# Altium schematic sheet G431_Dev_V2.SchDoc: G431 DEV BRD
size A2; Author: OldGerman; Address1: Author: OldGerman; Address2: License: CC BY-SA 4.0; Revision: v1.0
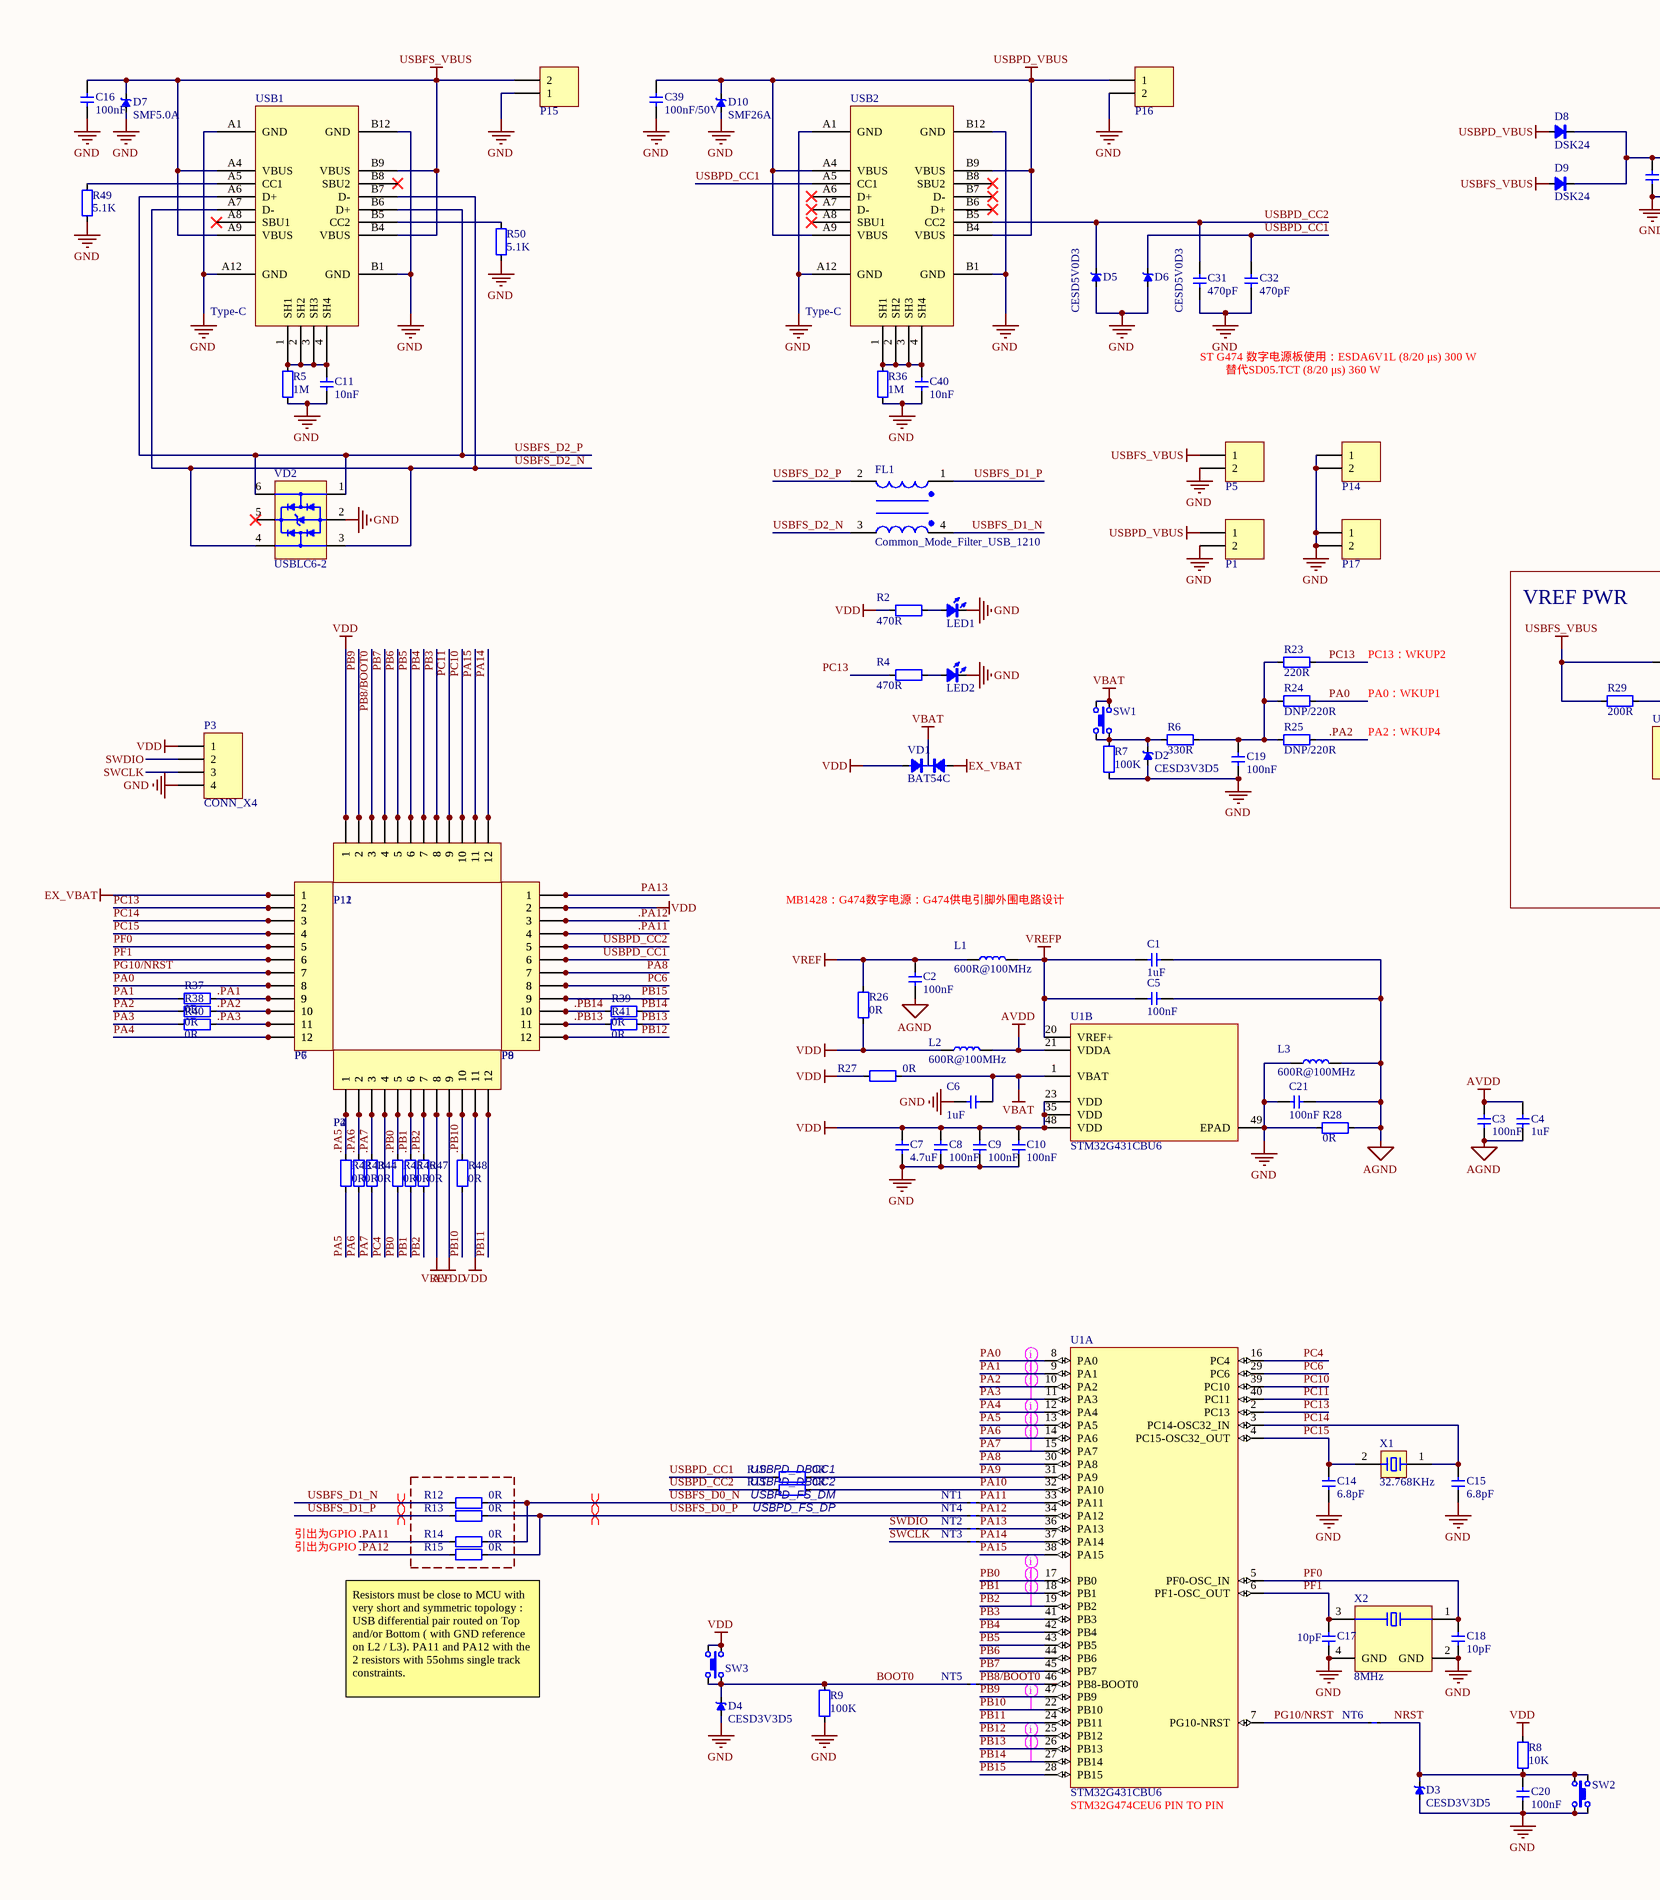
[diagram p0: G431_Dev_V2.SchDoc, left]
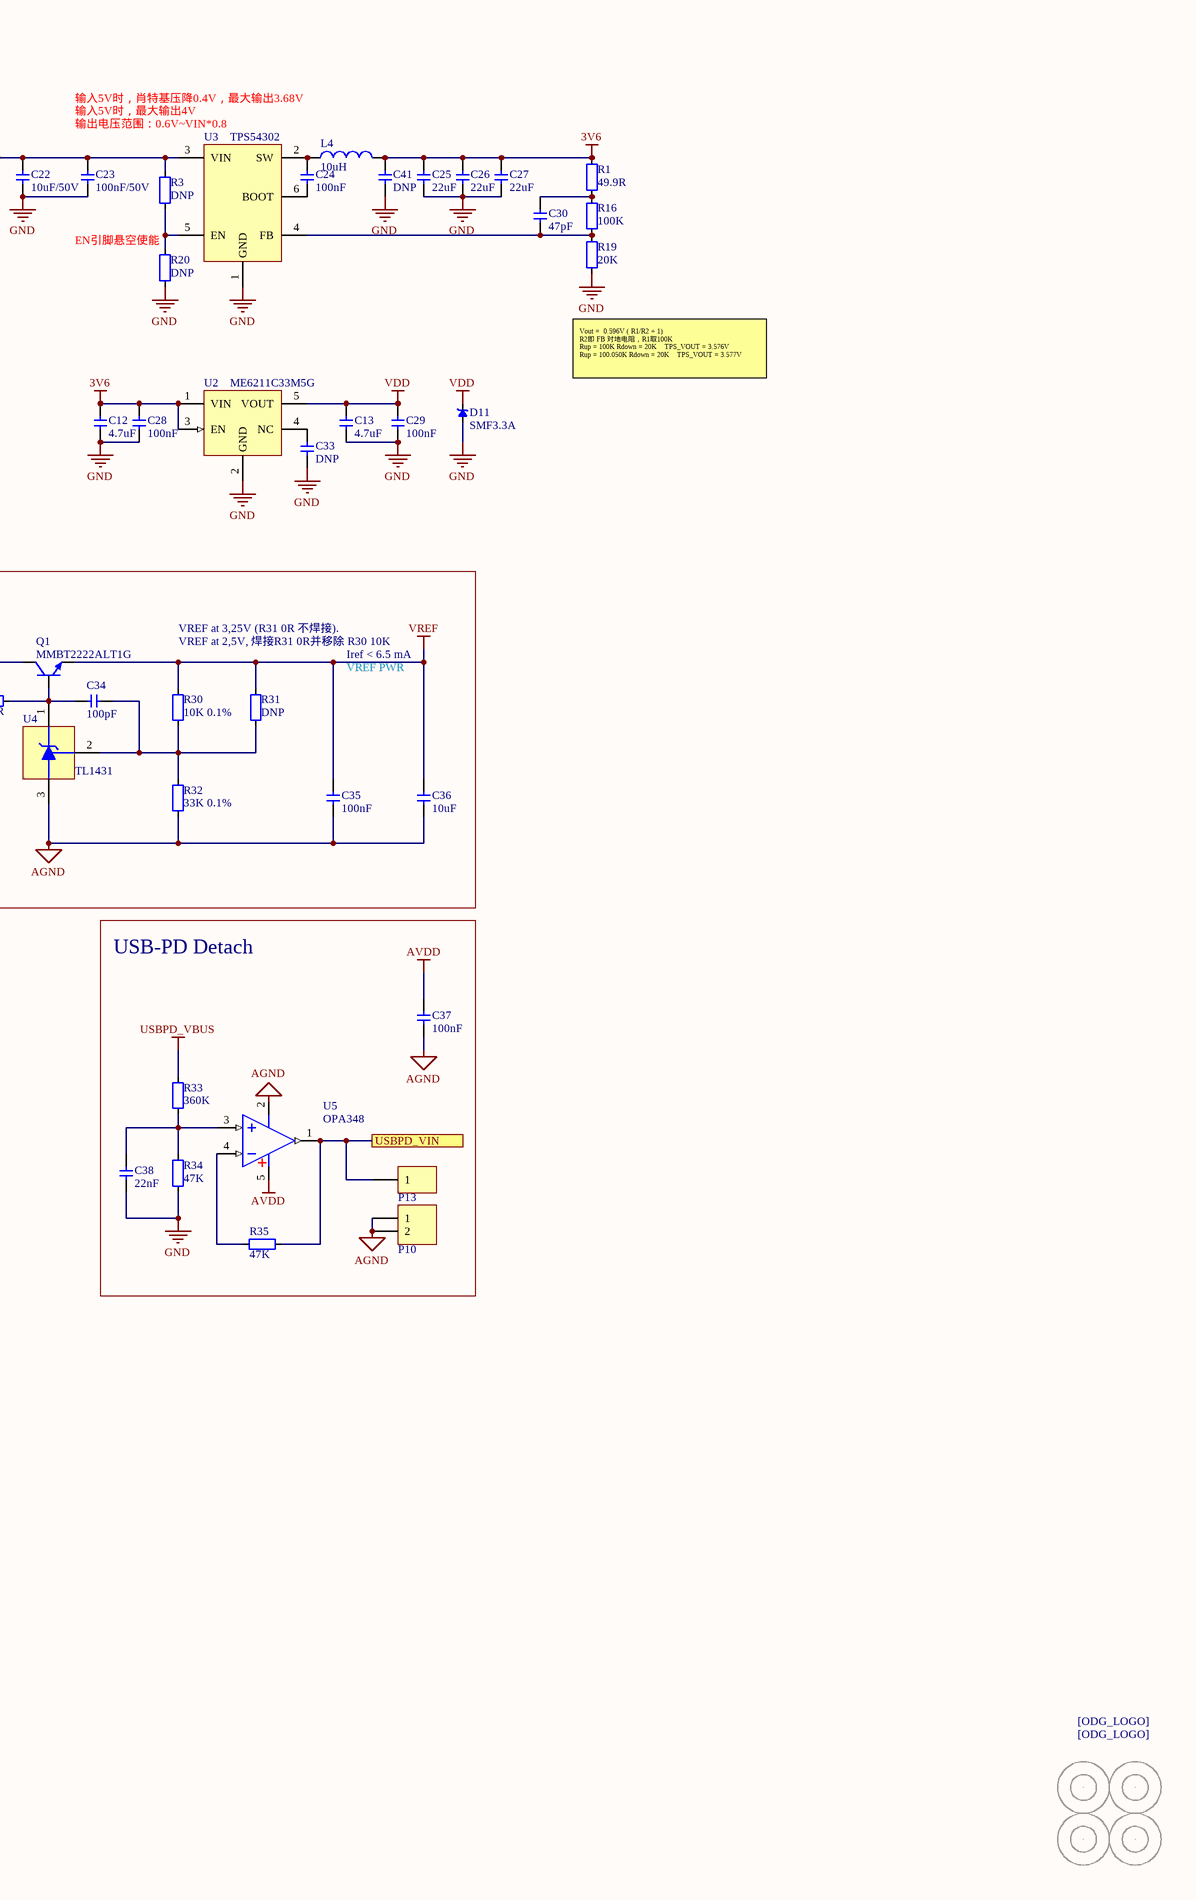
[diagram p1: G431_Dev_V2.SchDoc, right]

## Parts
*1  ODG_LOGO  [ODG_LOGO]  (value not drawn)
*2  ODG_LOGO  [ODG_LOGO]  (value not drawn)
C1  1uF  [C0603]
C2  100nF  [C0402]
C3  100nF  [C0402]
C4  1uF  [C0603]
C5  100nF  [C0402]
C6  1uF  [C0603]
C7  4.7uF  [C0603]
C8  100nF  [C0402]
C9  100nF  [C0402]
C10  100nF  [C0402]
C11  10nF  [C0402]
C12  4.7uF  [C0603]
C13  4.7uF  [C0603]
C14  6.8pF  [C0402]
C15  6.8pF  [C0402]
C16  100nF  [C0402]
C17  10pF  [C0402]
C18  10pF  [C0402]
C19  100nF  [C0402]
C20  100nF  [C0402]
C21  100nF  [C0402]
C22  10uF/50V  [C1206]
C23  100nF/50V  [C0402]
C24  100nF  [C0402]
C25  22uF  [C0805]
C26  22uF  [C0805]
C27  22uF  [C0603]
C28  100nF  [C0402]
C29  100nF  [C0402]
C30  47pF  [C0402]
C31  470pF  [C0402]
C32  470pF  [C0402]
C33  DNP  [C0402]
C34  100pF  [C0402]
C35  100nF  [C0402]
C36  10uF  [C0603]
C37  100nF  [C0402]
C38  22nF  [C0402]
C39  100nF/50V  [C0402]
C40  10nF  [C0402]
C41  DNP  [C0805]
D2  CESD3V3D5  [SOD-523]
D3  CESD3V3D5  [SOD-523]
D4  CESD3V3D5  [SOD-523]
D5  CESD5V0D3  [SOD-323]
D6  CESD5V0D3  [SOD-323]
D7  SMF5.0A  [SOD123F]
D8  DSK24  [SOD123F]
D9  DSK24  [SOD123F]
D10  SMF26A  [SOD123F]
D11  SMF3.3A  [SOD123F]
FL1  Common_Mode_Filter_USB_1210  [FIL_1210_DLP11RB400UL2L]
H1  HOLE  [M2.1 D=4.2]  (value not drawn)
H2  HOLE  [M2.1 D=4.2]  (value not drawn)
H3  HOLE  [M2.1 D=4.2]  (value not drawn)
H4  HOLE  [M2.1 D=4.2]  (value not drawn)
L1  600R@100MHz  [FER0603]
L2  600R@100MHz  [FER0603]
L3  600R@100MHz  [FER0603]
L4  10uH  [INDUCTOR 0420 4.6X4.1X2MM]
LED1  LED  [LED0603_GREEN]  (value not drawn)
LED2  LED  [LED0603_BLUE]  (value not drawn)
NT1  NetTie  [NetTie_D=10MIL_C=10MIL]  (value not drawn)  (net tie, no BOM)
NT2  NetTie  [NetTie_D=10MIL_C=10MIL]  (value not drawn)  (net tie, no BOM)
NT3  NetTie  [NetTie_D=10MIL_C=10MIL]  (value not drawn)  (net tie, no BOM)
NT4  NetTie  [NetTie_D=10MIL_C=10MIL]  (value not drawn)  (net tie, no BOM)
NT5  NetTie  [NetTie_D=10MIL_C=10MIL]  (value not drawn)  (net tie, no BOM)
NT6  NetTie  [NetTie_D=10MIL_C=10MIL]  (value not drawn)  (net tie, no BOM)
P1  CONN_X2  [2.54mm_Male_x2]  (value not drawn)
P2  CONN_X12  [2.54MM_MALE_X12]  (value not drawn)
P3  CONN_X4  [2.54mm_Male_x4]
P4  CONN_X12  [2.54MM_MALE_X12]  (value not drawn)
P5  CONN_X2  [2.54mm_Male_x2]  (value not drawn)
P6  CONN_X12  [2.54MM_MALE_X12]  (value not drawn)
P7  CONN_X12  [2.54MM_MALE_X12]  (value not drawn)
P8  CONN_X12  [2.54MM_MALE_X12]  (value not drawn)
P9  CONN_X12  [2.54MM_MALE_X12]  (value not drawn)
P10  CONN_X2  [2.54mm_Male_x2]  (value not drawn)
P11  CONN_X12  [2.54MM_MALE_X12]  (value not drawn)
P12  CONN_X12  [2.54MM_MALE_X12]  (value not drawn)
P13  CONN_X1  [2.54mm_Male_x1]  (value not drawn)
P14  CONN_X2  [2.54mm_Male_x2]  (value not drawn)
P15  CONN_X2  [TE_1776275-2]  (value not drawn)
P16  CONN_X2  [TE_1776275-2]  (value not drawn)
P17  CONN_X2  [2.54mm_Male_x2]  (value not drawn)
Q1  MMBT2222ALT1G  [INFINEON SOT-23-3]
R1  49.9R  [R0402]
R2  470R  [R0402]
R3  DNP  [R0402]
R4  470R  [R0402]
R5  1M  [R0402]
R6  330R  [R0402]
R7  100K  [R0402]
R8  10K  [R0402]
R9  100K  [R0402]
R10  0R  [R0402]
R11  0R  [R0402]
R12  0R  [R0402]
R13  0R  [R0402]
R14  0R  [R0402]
R15  0R  [R0402]
R16  100K  [R0402]
R19  20K  [R0402]
R20  DNP  [R0402]
R23  220R  [R0402]
R24  DNP/220R  [R0402]
R25  DNP/220R  [R0402]
R26  0R  [R0402]
R27  0R  [R0402]
R28  0R  [R0402]
R29  200R  [R0402]
R30  10K 0.1%  [R0402]
R31  DNP  [R0402]
R32  33K 0.1%  [R0402]
R33  360K  [R0402]
R34  47K  [R0402]
R35  47K  [R0402]
R36  1M  [R0402]
R37  0R  [RES_TINY_0402]
R38  0R  [RES_TINY_0402]
R39  0R  [RES_TINY_0402]
R40  0R  [RES_TINY_0402]
R41  0R  [RES_TINY_0402]
R42  0R  [RES_TINY_0402]
R43  0R  [RES_TINY_0402]
R44  0R  [RES_TINY_0402]
R45  0R  [RES_TINY_0402]
R46  0R  [RES_TINY_0402]
R47  0R  [RES_TINY_0402]
R48  0R  [RES_TINY_0402]
R49  5.1K  [R0402]
R50  5.1K  [R0402]
SW1  Button-4P  [SWITCH_3X4X2.5_4PIN_SMD]  (value not drawn)
SW2  Button-4P  [SWITCH_3X4X2.5_4PIN_SMD]  (value not drawn)
SW3  Button-4P  [SWITCH_3X4X2.5_4PIN_SMD]  (value not drawn)
U1  STM32G431CBU6  [UFQFPN-48_7X7X0P55MM]  (parts A,B of 2)
U2  ME6211C33M5G  [ANALOG TSOT-23-5 UJ-5]
U3  TPS54302  [MICROCHIP SOT-23-6 M6]
U4  TL1431  [INFINEON SOT-23-3]
U5  OPA348  [ANALOG SOT-23-5 RJ-5]
USB1  Type-C  [Type-C-TOP]
USB2  Type-C  [Type-C-TOP]
VD1  BAT54C  [INFINEON SOT-23-3]
VD2  USBLC6-2  [MICROCHIP SOT-23-6 M6]
X1  32.768KHz  [XTAL_2P_3215]
X2  8MHz  [EPSON TSX-3225]

## Blocks framed on the sheet
VREF PWR: C34-C36 Q1 R29-R32 U4
USB-PD Detach: C37 C38 P10 P13 R33-R35 U5

## Ports
USBPD_VIN

## Nets
3V6: C12.2 C25.1 C26.1 C27.1 C28.1 C41.2 L4.2 R1.1 U2.1(VIN) U2.3(EN)
AGND: C1.2 C2.1 C3.1 C4.1 C5.2 C21.1 C35.2 C36.2 C37.2 L3.2 P10.1 P10.2 R28.1 R32.1 U4.3(Anode) U5.2(V-)
AVDD: C3.2 C4.2 C37.1 L2.2 P2.9 P4.9 U1.21(VDDA) U5.5(V+)
EX_VBAT: P6.1 P7.1 VD1.2
GND: C6.1 C7.1 C8.1 C9.1 C10.1 C11.1 C12.1 C13.1 C14.2 C15.2 C16.2 C17.2 C18.2 C19.1 C20.1 C21.2 C22.2 C23.2 C25.2 C26.2 C27.2 C28.2 C29.2 C31.1 C32.2 C33.2 C38.2 C39.2 C40.1 C41.1 D2.1 D3.1 D4.1 D5.1 D6.1 D7.1 D10.1 D11.1 L3.1 LED1.2(K) LED2.2(K) P1.2 P3.4 P5.2 P14.1 P14.2 P15.1 P16.2 P17.1 P17.2 R5.1 R7.2 R9.2 R19.2 R20.2 R28.2 R34.2 R36.1 R49.1 R50.2 SW2.3 SW2.4 U1.49(EPAD) U2.2(GND) U3.1(GND) USB1.A1(GND) USB1.A12(GND) USB1.B1(GND) USB1.B12(GND) USB2.A1(GND) USB2.A12(GND) USB2.B1(GND) USB2.B12(GND) VD2.2(GND) X2.2(GND) X2.4(GND)
USBFS_VBUS: C16.1 D7.2 D9.1(A) P5.1 P15.2 Q1.3(C) R29.2 USB1.A4(VBUS) USB1.A9(VBUS) USB1.B4(VBUS) USB1.B9(VBUS)
USBPD_VBUS: C39.1 D8.1(A) D10.2 P1.1 P16.1 R33.2 USB2.A4(VBUS) USB2.A9(VBUS) USB2.B4(VBUS) USB2.B9(VBUS)
VBAT: C6.2 R27.2 SW1.3 SW1.4 U1.1(VBAT) VD1.3
VDD: C7.2 C8.2 C9.2 C10.2 C13.2 C29.1 D11.2 L2.1 P2.11 P3.1 P4.11 P8.2 P9.2 P11.1 P12.1 R2.1 R8.1 R26.1 R27.1 SW3.3 SW3.4 U1.23(VDD) U1.35(VDD) U1.48(VDD) U2.5(VOUT) VD1.1
VREF: C2.2 C35.1 C36.1 L1.1 P2.8 P4.8 Q1.2(E) R26.2 R30.2 R31.2
VREFP: C1.1 C5.1 L1.2 U1.20(VREF+)
.PA1: P6.9 P7.9 R37.2
.PA2: P6.10 P7.10 R25.1 R38.2
.PA3: P6.11 P7.11 R40.2
.PA5: P2.1 P4.1 R42.1
.PA6: P2.2 P4.2 R43.1
.PA7: P2.3 P4.3 R44.1
.PA11: P8.4 P9.4 R14.1
.PA12: P8.3 P9.3 R15.1
.PB0: P2.5 P4.5 R45.1
.PB1: P2.6 P4.6 R46.1
.PB2: P2.7 P4.7 R47.1
.PB10: P2.10 P4.10 R48.1
.PB13: P8.11 P9.11 R41.1
.PB14: P8.10 P9.10 R39.1
BOOT0: D4.2 NT5.2 R9.1 SW3.1 SW3.2
NRST: C20.2 D3.2 NT6.1 R8.2 SW2.1 SW2.2
PA0: P6.8 P7.8 R24.1 U1.8(PA0)
PA1: R37.1 U1.9(PA1)
PA2: R38.1 U1.10(PA2)
PA3: R40.1 U1.11(PA3)
PA4: P6.12 P7.12 U1.12(PA4)
PA5: R42.2 U1.13(PA5)
PA6: R43.2 U1.14(PA6)
PA7: R44.2 U1.15(PA7)
PA8: P8.7 P9.7 U1.30(PA8)
PA9: R10.2 U1.31(PA9)
PA10: R11.2 U1.32(PA10)
PA11: NT1.1 U1.33(PA11)
PA12: NT4.1 U1.34(PA12)
PA13: NT2.1 P8.1 P9.1 U1.36(PA13)
PA14: NT3.1 P11.12 P12.12 U1.37(PA14)
PA15: P11.11 P12.11 U1.38(PA15)
PB0: R45.2 U1.17(PB0)
PB1: R46.2 U1.18(PB1)
PB2: R47.2 U1.19(PB2)
PB3: P11.8 P12.8 U1.41(PB3)
PB4: P11.7 P12.7 U1.42(PB4)
PB5: P11.6 P12.6 U1.43(PB5)
PB6: P11.5 P12.5 U1.44(PB6)
PB7: P11.4 P12.4 U1.45(PB7)
PB8/BOOT0: NT5.1 P11.3 P12.3 U1.46(PB8-BOOT0)
PB9: P11.2 P12.2 U1.47(PB9)
PB10: R48.2 U1.22(PB10)
PB11: P2.12 P4.12 U1.24(PB11)
PB12: P8.12 P9.12 U1.25(PB12)
PB13: R41.2 U1.26(PB13)
PB14: R39.2 U1.27(PB14)
PB15: P8.9 P9.9 U1.28(PB15)
PC4: P2.4 P4.4 U1.16(PC4)
PC6: P8.8 P9.8 U1.29(PC6)
PC10: P11.10 P12.10 U1.39(PC10)
PC11: P11.9 P12.9 U1.40(PC11)
PC13: P6.2 P7.2 R4.1 R23.1 U1.2(PC13)
PC14: C15.1 P6.3 P7.3 U1.3(PC14-OSC32_IN) X1.1
PC15: C14.1 P6.4 P7.4 U1.4(PC15-OSC32_OUT) X1.2
PF0: C18.1 P6.5 P7.5 U1.5(PF0-OSC_IN) X2.1
PF1: C17.1 P6.6 P7.6 U1.6(PF1-OSC_OUT) X2.3
PG10/NRST: NT6.2 P6.7 P7.7 U1.7(PG10-NRST)
SWCLK: NT3.2 P3.3
SWDIO: NT2.2 P3.2
USBFS_D0_N: NT1.2 R12.2 R14.2
USBFS_D0_P: NT4.2 R13.2 R15.2
USBFS_D1_N: FL1.4 R12.1
USBFS_D1_P: FL1.1 R13.1
USBFS_D2_N: FL1.3 USB1.A7(D-) USB1.B7(D-) VD2.3(I/O2) VD2.4(I/O2)
USBFS_D2_P: FL1.2 USB1.A6(D+) USB1.B6(D+) VD2.1(I/O1) VD2.6(I/O1)
USBPD_CC1: C32.1 D6.2 P8.6 P9.6 R10.1 USB2.A5(CC1)
USBPD_CC2: C31.2 D5.2 P8.5 P9.5 R11.1 USB2.B5(CC2)
USBPD_VIN: P13.1 R35.1 U5.1(OUT) ; port USBPD_VIN
NetC11_2: C11.2 R5.2 USB1.1(SH1) USB1.2(SH2) USB1.3(SH3) USB1.4(SH4)
NetC19_2: C19.2 R6.1 R23.2 R24.2 R25.2
NetC22_1: C22.1 C23.1 D8.2(C) D9.2(C) R3.1 U3.3(VIN)
NetC24_1: C24.1 U3.6(BOOT)
NetC24_2: C24.2 L4.1 U3.2(SW)
NetC30_1: C30.1 R1.2 R16.1
NetC30_2: C30.2 R16.2 R19.1 U3.4(FB)
NetC33_1: C33.1 U2.4(NC)
NetC34_1: C34.1 R30.1 R31.1 R32.2 U4.2(Ref)
NetC34_2: C34.2 Q1.1(B) R29.1 U4.1(Cathode)
NetC38_1: C38.1 R33.1 R34.1 U5.3(IN+)
NetC40_2: C40.2 R36.2 USB2.1(SH1) USB2.2(SH2) USB2.3(SH3) USB2.4(SH4)
NetD2_2: D2.2 R6.2 R7.1 SW1.1 SW1.2
NetLED1_1: LED1.1(A) R2.2
NetLED2_1: LED2.1(A) R4.2
NetR3_2: R3.2 R20.1 U3.5(EN)
NetR35_2: R35.2 U5.4(IN-)
NetR49_2: R49.2 USB1.A5(CC1)
NetR50_1: R50.1 USB1.B5(CC2)

Not connected (* = marked no-connect by the designer): H1 1; H2 1; H3 1; H4 1; USB1 A8(SBU1)* B8(SBU2)*; USB2 A6(D+)* A7(D-)* A8(SBU1)* B6(D+)* B7(D-)* B8(SBU2)*; VD2 5(VBUS)*

## Layout directives
net class opa: PA1, PA2, PA3, PA5, PA6, PA7, PB0, PB1, PB2, PB10, PB13, PB14
differential pair: USBFS_D0_N, USBFS_D0_P, USBFS_D1_N, USBFS_D1_P

## Notes on the sheet
- 输出电压范围：0.6V~VIN*0.8
- 输入5V时，最大输出4V
- 输入5V时，肖特基压降0.4V，最大输出3.68V
- EN引脚悬空使能
- ST G474 数字电源板使用：ESDA6V1L (8/20 μs) 300 W
- 替代SD05.TCT (8/20 μs) 360 W
- Vout =  0.596V ( R1/R2 + 1)
  R2即 FB 对地电阻，R1取100K
  Rup = 100K Rdown = 20K    TPS_VOUT = 3.576V
  Rup = 100.050K Rdown = 20K    TPS_VOUT = 3.577V
- PC13：WKUP2
- VREF at 3,25V (R31 0R 不焊接).
- VREF at 2,5V, 焊接R31 0R并移除 R30 10K
- Iref < 6.5 mA
- PA0：WKUP1
- VREF PWR
- PA2：WKUP4
- MB1428：G474数字电源：G474供电引脚外围电路设计
- USBPD_DBCC1
- USBPD_DBCC2
- USBPD_FS_DM
- 引出为GPIO
- USBPD_FS_DP
- Resistors must be close to MCU with very short and symmetric topology : USB differential pair routed on Top and/or Bottom ( with GND reference on L2 / L3). PA11 and PA12 with the 2 resistors with 55ohms single track constraints.
- (near U1) STM32G474CEU6 PIN TO PIN
- Title
- Size:
- Date:
- File:
- A2
- Number:
- Time:
- Revision:
- Sheet
- of
- (in symbol ODG_LOGO) [ODG_LOGO]

## Library data of the parts
C1-C41 = CAP: Capacitor
D2-D7 D10 D11 = TVS_U: 极性：Unidirectional; MF: Taiwan Semiconductor Corporation; MP: TESD5V0L1UC RJG; Digi-Key_Part_Number: TESD5V0L1UCRJGTR-ND; Check_prices: https://www.snapeda.com/parts/TESD5V0L1UC%20RJG/Taiwan+Semiconductor/view-part/?ref=eda; SnapEDA_Link: https://www.snapeda.com/parts/TESD5V0L1UC%20RJG/Taiwan+Semiconductor/view-part/?ref=snap; Package: DFN1006L Taiwan Semiconductor; Purchase-URL: https://pricing.snapeda.com/search/part/TESD5V0L1UC RJG/?ref=eda; Value: *
D8 D9 = DIODE: 二极管
FL1 = Common_Mode_Filter_USB: Chip Common Mode Choke Coil; MP: DLP11RB400UL2L; Package: None; Price: None; Value: *; Availability: Unavailable
L1-L3 = inductor_mini: 贴片叠层电感
L4 = Inductor_power: 功率电感
LED1 LED2 = LED: Value: color?
NT1-NT6 = NetTie: Net Tie; Part Number: NetTie 0.2mm; Value: NetTie_200um; Artikkelnr Noca: N.A.; Pad Count: 2; ComponentLink1Description: Datasheet; ComponentLink2Description: Supplier link; Footprint Doc: NetTie; LatestRevisionDate: 2019-10-07; Pin Count: 2; Publisher: Nordic Semiconductor; Published: 2019-10-07; Part number IPS: N.A.; Component Class: Connectors; PartId: 100500654
Q1 = NPN: NPN型
R1-R16 R19 R20 R23-R50 = RES: IEC Standard
SW1-SW3 = Button-4P: Button
U1 = STM32G431CBU6: Mfr_Name: STMicroelectronics; Copyright: Copyright (C) 2023 Ultra Librarian. All rights reserved.; Manufacturer_Part_Number: STM32G431CBU6; RefDes: RefDes; Type: DEV
U2 = ME6211C33M5G: 线性稳压芯片
U3 = TPS54302: 4.5-V to 28-V Input, 3-A Output, EMI Friendly Synchronous Step Down Converter
U4 = TL1431 (SOT23-3): Programmable voltage reference
U5 = AD8605ARTZ: 精密、低噪声、CMOS、轨到轨输入/输出运算放大器; ComponentLink1Description: https://www.analog.com/media/cn/technical-documentation/data-sheets/AD8605_8606_8608_cn.pdf; ComponentLink1URL: https://www.analog.com/media/cn/technical-documentation/data-sheets/AD8605_8606_8608_cn.pdf
USB1 USB2 = USB-Type-C_16P
VD1 = BAT54C: 贴片肖特基二极管
VD2 = USBLC6-2: Very low capacitance ESD protection / Features / • 2 data-line protection / • Protects VBUS / • Very low capacitance: 3.5 pF max. / • Very low leakage current: 150 nA max. / • SOT-666 and SOT23-6L packages / • RoHS compliant
X1 = XTAL-2P: 2脚无源石英晶振; BOM名称: 4脚无源晶振; 版权归属: 源创客; 学习资源: www.ooocke.com
X2 = XTAL-4P: 4脚无源石英晶振; BOM名称: 4脚无源晶振; 版权归属: 源创客; 学习资源: www.ooocke.com